# EAGLE design BitAccumulator (EAGLE 9.2.2)
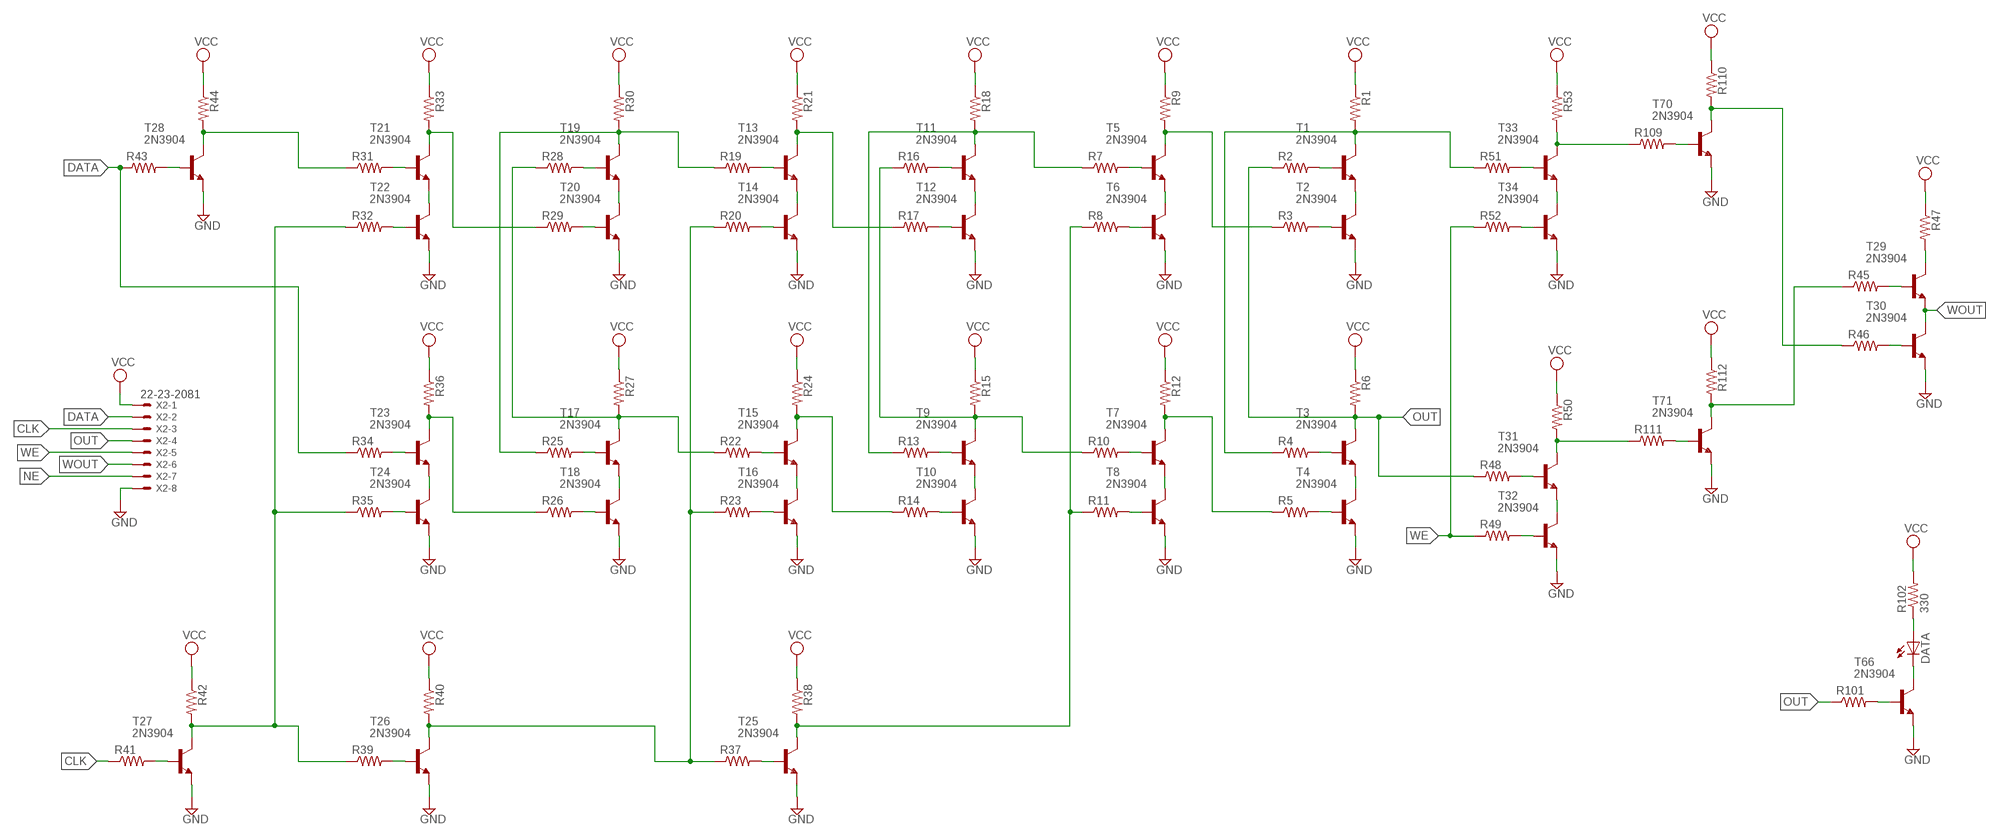
[diagram p0: schematic, sheet 1]

## Parts
DATA  LED5MM  [LED5MM]
R1  R-US_0309/10  [0309/10]
R2  R-US_0309/10  [0309/10]
R3  R-US_0309/10  [0309/10]
R4  R-US_0309/10  [0309/10]
R5  R-US_0309/10  [0309/10]
R6  R-US_0309/10  [0309/10]
R7  R-US_0309/10  [0309/10]
R8  R-US_0309/10  [0309/10]
R9  R-US_0309/10  [0309/10]
R10  R-US_0309/10  [0309/10]
R11  R-US_0309/10  [0309/10]
R12  R-US_0309/10  [0309/10]
R13  R-US_0309/10  [0309/10]
R14  R-US_0309/10  [0309/10]
R15  R-US_0309/10  [0309/10]
R16  R-US_0309/10  [0309/10]
R17  R-US_0309/10  [0309/10]
R18  R-US_0309/10  [0309/10]
R19  R-US_0309/10  [0309/10]
R20  R-US_0309/10  [0309/10]
R21  R-US_0309/10  [0309/10]
R22  R-US_0309/10  [0309/10]
R23  R-US_0309/10  [0309/10]
R24  R-US_0309/10  [0309/10]
R25  R-US_0309/10  [0309/10]
R26  R-US_0309/10  [0309/10]
R27  R-US_0309/10  [0309/10]
R28  R-US_0309/10  [0309/10]
R29  R-US_0309/10  [0309/10]
R30  R-US_0309/10  [0309/10]
R31  R-US_0309/10  [0309/10]
R32  R-US_0309/10  [0309/10]
R33  R-US_0309/10  [0309/10]
R34  R-US_0309/10  [0309/10]
R35  R-US_0309/10  [0309/10]
R36  R-US_0309/10  [0309/10]
R37  R-US_0309/10  [0309/10]
R38  R-US_0309/10  [0309/10]
R39  R-US_0309/10  [0309/10]
R40  R-US_0309/10  [0309/10]
R41  R-US_0309/10  [0309/10]
R42  R-US_0309/10  [0309/10]
R43  R-US_0309/10  [0309/10]
R44  R-US_0309/10  [0309/10]
R45  R-US_0309/10  [0309/10]
R46  R-US_0309/10  [0309/10]
R47  R-US_0309/10  [0309/10]
R48  R-US_0309/10  [0309/10]
R49  R-US_0309/10  [0309/10]
R50  R-US_0309/10  [0309/10]
R51  R-US_0309/10  [0309/10]
R52  R-US_0309/10  [0309/10]
R53  R-US_0309/10  [0309/10]
R101  R-US_0309/10  [0309/10]
R102  330  R-US_0309/10  [0309/10]
R109  R-US_0309/10  [0309/10]
R110  R-US_0309/10  [0309/10]
R111  R-US_0309/10  [0309/10]
R112  R-US_0309/10  [0309/10]
T1  2N3904  [TO92]
T2  2N3904  [TO92]
T3  2N3904  [TO92]
T4  2N3904  [TO92]
T5  2N3904  [TO92]
T6  2N3904  [TO92]
T7  2N3904  [TO92]
T8  2N3904  [TO92]
T9  2N3904  [TO92]
T10  2N3904  [TO92]
T11  2N3904  [TO92]
T12  2N3904  [TO92]
T13  2N3904  [TO92]
T14  2N3904  [TO92]
T15  2N3904  [TO92]
T16  2N3904  [TO92]
T17  2N3904  [TO92]
T18  2N3904  [TO92]
T19  2N3904  [TO92]
T20  2N3904  [TO92]
T21  2N3904  [TO92]
T22  2N3904  [TO92]
T23  2N3904  [TO92]
T24  2N3904  [TO92]
T25  2N3904  [TO92]
T26  2N3904  [TO92]
T27  2N3904  [TO92]
T28  2N3904  [TO92]
T29  2N3904  [TO92]
T30  2N3904  [TO92]
T31  2N3904  [TO92]
T32  2N3904  [TO92]
T33  2N3904  [TO92]
T34  2N3904  [TO92]
T66  2N3904  [TO92]
T70  2N3904  [TO92]
T71  2N3904  [TO92]
X2  22-23-2081  [22-23-2081]

## Nets
CLK: R41.1 X2.3
DATA: R34.1 R43.1 X2.2
GND: T2.3(E) T4.3(E) T6.3(E) T8.3(E) T10.3(E) T12.3(E) T14.3(E) T16.3(E) T18.3(E) T20.3(E) T22.3(E) T24.3(E) T25.3(E) T26.3(E) T27.3(E) T28.3(E) T30.3(E) T32.3(E) T34.3(E) T66.3(E) T70.3(E) T71.3(E) X2.8
N$1: R31.1 R44.2 T28.1(C)
N$2: R43.2 T28.2(B)
N$3: T31.3(E) T32.1(C)
N$4: R41.2 T27.2(B)
N$5: R39.2 T26.2(B)
N$7: R37.2 T25.2(B)
N$8: R101.2 T66.2(B)
N$9: R29.1 R33.2 T21.1(C)
N$10: R31.2 T21.2(B)
N$11: R32.2 T22.2(B)
N$12: R46.2 T30.2(B)
N$13: R28.2 T19.2(B)
N$14: R29.2 T20.2(B)
N$15: T19.3(E) T20.1(C)
N$16: R19.1 R25.1 R30.2 T19.1(C)
N$17: R17.1 R21.2 T13.1(C)
N$18: T13.3(E) T14.1(C)
N$19: R20.2 T14.2(B)
N$20: R19.2 T13.2(B)
N$21: R26.1 R36.2 T23.1(C)
N$22: T23.3(E) T24.1(C)
N$23: R35.2 T24.2(B)
N$24: R34.2 T23.2(B)
N$25: R25.2 T17.2(B)
N$26: R22.1 R27.2 R28.1 T17.1(C)
N$27: T17.3(E) T18.1(C)
N$28: R26.2 T18.2(B)
N$29: R22.2 T15.2(B)
N$30: R23.2 T16.2(B)
N$31: T15.3(E) T16.1(C)
N$32: R10.1 R15.2 R16.1 T9.1(C)
N$33: R7.1 R13.1 R18.2 T11.1(C)
N$34: T11.3(E) T12.1(C)
N$35: R17.2 T12.2(B)
N$36: R16.2 T11.2(B)
N$37: R45.2 T29.2(B)
N$38: R13.2 T9.2(B)
N$39: R14.2 T10.2(B)
N$40: T9.3(E) T10.1(C)
N$41: R3.1 R9.2 T5.1(C)
N$42: R7.2 T5.2(B)
N$43: R8.2 T6.2(B)
N$44: T5.3(E) T6.1(C)
N$45: R5.1 R12.2 T7.1(C)
N$46: R10.2 T7.2(B)
N$47: R11.2 T8.2(B)
N$48: T7.3(E) T8.1(C)
N$49: R5.2 T4.2(B)
N$50: R4.2 T3.2(B)
N$51: DATA.A R102.1
N$52: T3.3(E) T4.1(C)
N$53: R3.2 T2.2(B)
N$54: R2.2 T1.2(B)
N$55: T1.3(E) T2.1(C)
N$56: R1.2 R4.1 R51.1 T1.1(C)
N$57: R53.2 R109.1 T33.1(C)
N$58: T33.3(E) T34.1(C)
N$59: R14.1 R24.2 T15.1(C)
N$60: R51.2 T33.2(B)
N$61: R52.2 T34.2(B)
N$62: DATA.K(C) T66.1(C)
N$63: T21.3(E) T22.1(C)
N$64: R49.2 T32.2(B)
N$65: R48.2 T31.2(B)
N$66: R50.2 R111.1 T31.1(C)
N$68: R8.1 R11.1 R38.2 T25.1(C)
N$99: R47.2 T29.1(C)
N$114: R32.1 R35.1 R39.1 R42.2 T27.1(C)
N$116: R20.1 R23.1 R37.1 R40.2 T26.1(C)
N$137: R109.2 T70.2(B)
N$138: R46.1 R110.2 T70.1(C)
N$139: R111.2 T71.2(B)
N$140: R45.1 R112.2 T71.1(C)
NE: X2.7
OUT: R2.1 R6.2 R48.1 R101.1 T3.1(C) X2.4
VCC: R1.1 R6.1 R9.1 R12.1 R15.1 R18.1 R21.1 R24.1 R27.1 R30.1 R33.1 R36.1 R38.1 R40.1 R42.1 R44.1 R47.1 R50.1 R53.1 R102.2 R110.1 R112.1 X2.1
WE: R49.1 R52.1 X2.5
WOUT: T29.3(E) T30.1(C) X2.6

## Library data of the parts
DATA = led:LED: LED OSRAM: - CHIPLED LG R971, LG N971, LY N971, LG Q971, LY Q971, LO R971, LY R971 LH N974, LH R974 LS Q976, LO Q976, LY Q976 LO Q996 - Hyper CHIPLED LW Q18S LB Q993, LB Q99A, LB R99A - SideLED LS A670, LO A670, LY A670, LG A670, LP A670 LB A673, LV A673, LT A673, LW A673 LH A674 LY A675 LS A676, LA A676, LO A676, LY A676, LW A676 LS A679, LY A679, LG A679 - Hyper Micro SIDELED® LS Y876, LA Y876, LO Y876, LY Y876 LT Y87S - SmartLED LW L88C, LW L88S LB L89C, LB L89S, LG L890 LS L89K, LO L89K, LY L89K LS L896, LA L896, LO L896, LY L896 - TOPLED LS T670, LO T670, LY T670, LG T670, LP T670 LSG T670, LSP T670, LSY T670, LOP T670, LYG T670 LG T671, LOG T671, LSG T671 LB T673, LV T673, LT T673, LW T673 LH T674 LS T676, LA T676, LO T676, LY T676, LB T676, LH T676, LSB T676, LW T676 LB T67C, LV T67C, LT T67C, LS T67K, LO T67K, LY T67K, LW E67C LS E67B, LA E67B, LO E67B, LY E67B, LB E67C, LV E67C, LT E67C LW T67C LS T679, LY T679, LG T679 LS T770, LO T770, LY T770, LG T770, LP T770 LB T773, LV T773, LT T773, LW T773 LH T774 LS E675, LA E675, LY E675, LS T675 LS T776, LA T776, LO T776, LY T776, LB T776 LHGB T686 LT T68C, LB T68C - Hyper Mini TOPLED® LB M676 - Mini TOPLED Santana® LG M470 LS M47K, LO M47K, LY M47K Source: http://www.osram.convergy.de LUXEON: - LUMILED® LXK2-PW12-R00, LXK2-PW12-S00, LXK2-PW14-U00, LXK2-PW14-V00 LXK2-PM12-R00, LXK2-PM12-S00, LXK2-PM14-U00 LXK2-PE12-Q00, LXK2-PE12-R00, LXK2-PE12-S00, LXK2-PE14-T00, LXK2-PE14-U00 LXK2-PB12-K00, LXK2-PB12-L00, LXK2-PB12-M00, LXK2-PB14-N00, LXK2-PB14-P00, LXK2-PB14-Q00 LXK2-PR12-L00, LXK2-PR12-M00, LXK2-PR14-Q00, LXK2-PR14-R00 LXK2-PD12-Q00, LXK2-PD12-R00, LXK2-PD12-S00 LXK2-PH12-R00, LXK2-PH12-S00 LXK2-PL12-P00, LXK2-PL12-Q00, LXK2-PL12-R00 Source: www.luxeon.com KINGBRIGHT: KA-3528ASYC Source: www.kingbright.com
R1-R53 R101 R102 R109-R112 = resistor:R-US_: RESISTOR, American symbol
T1-T34 T66 T70 T71 = transistor:2N3904: NPN TRANSISTOR
X2 = con-molex:22-23-2081: .100" (2.54mm) Center Header - 8 Pin; MF: MOLEX; MPN: 22-23-2081; OC_FARNELL: 1756826; OC_NEWARK: 01C7592

## Board
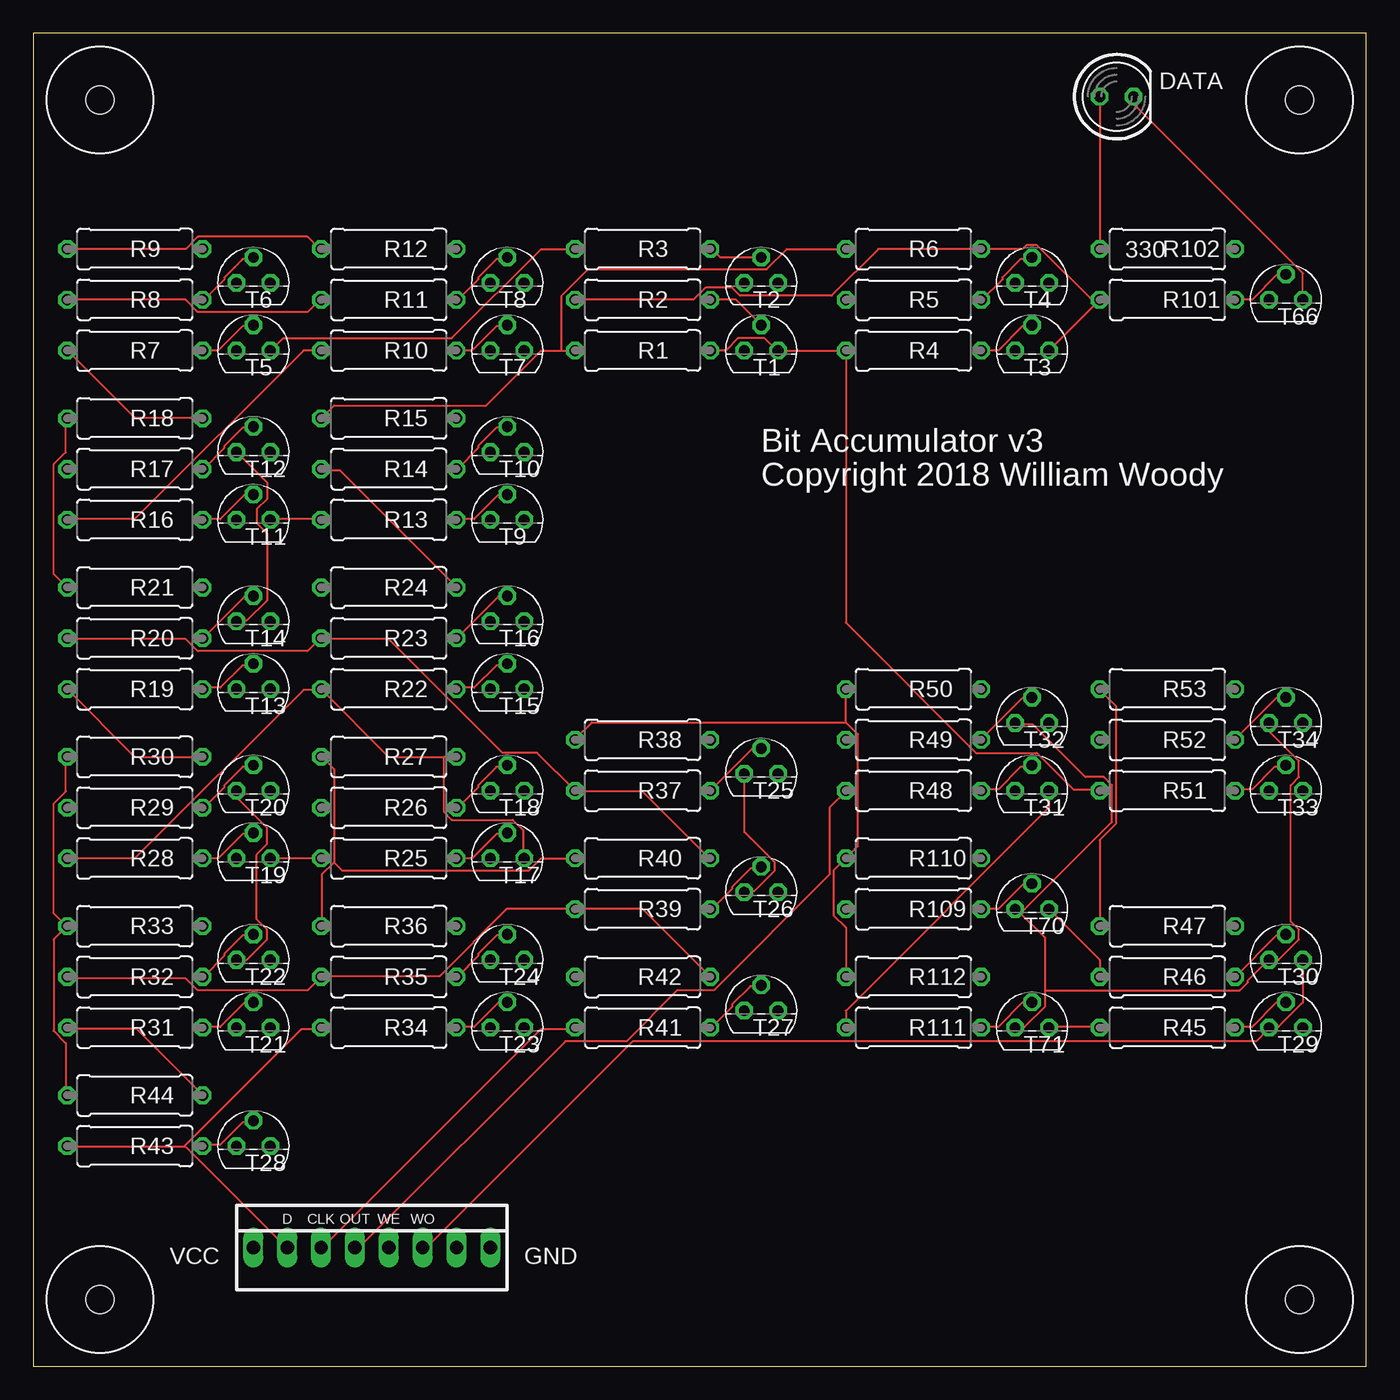
[diagram p1: board, top side]
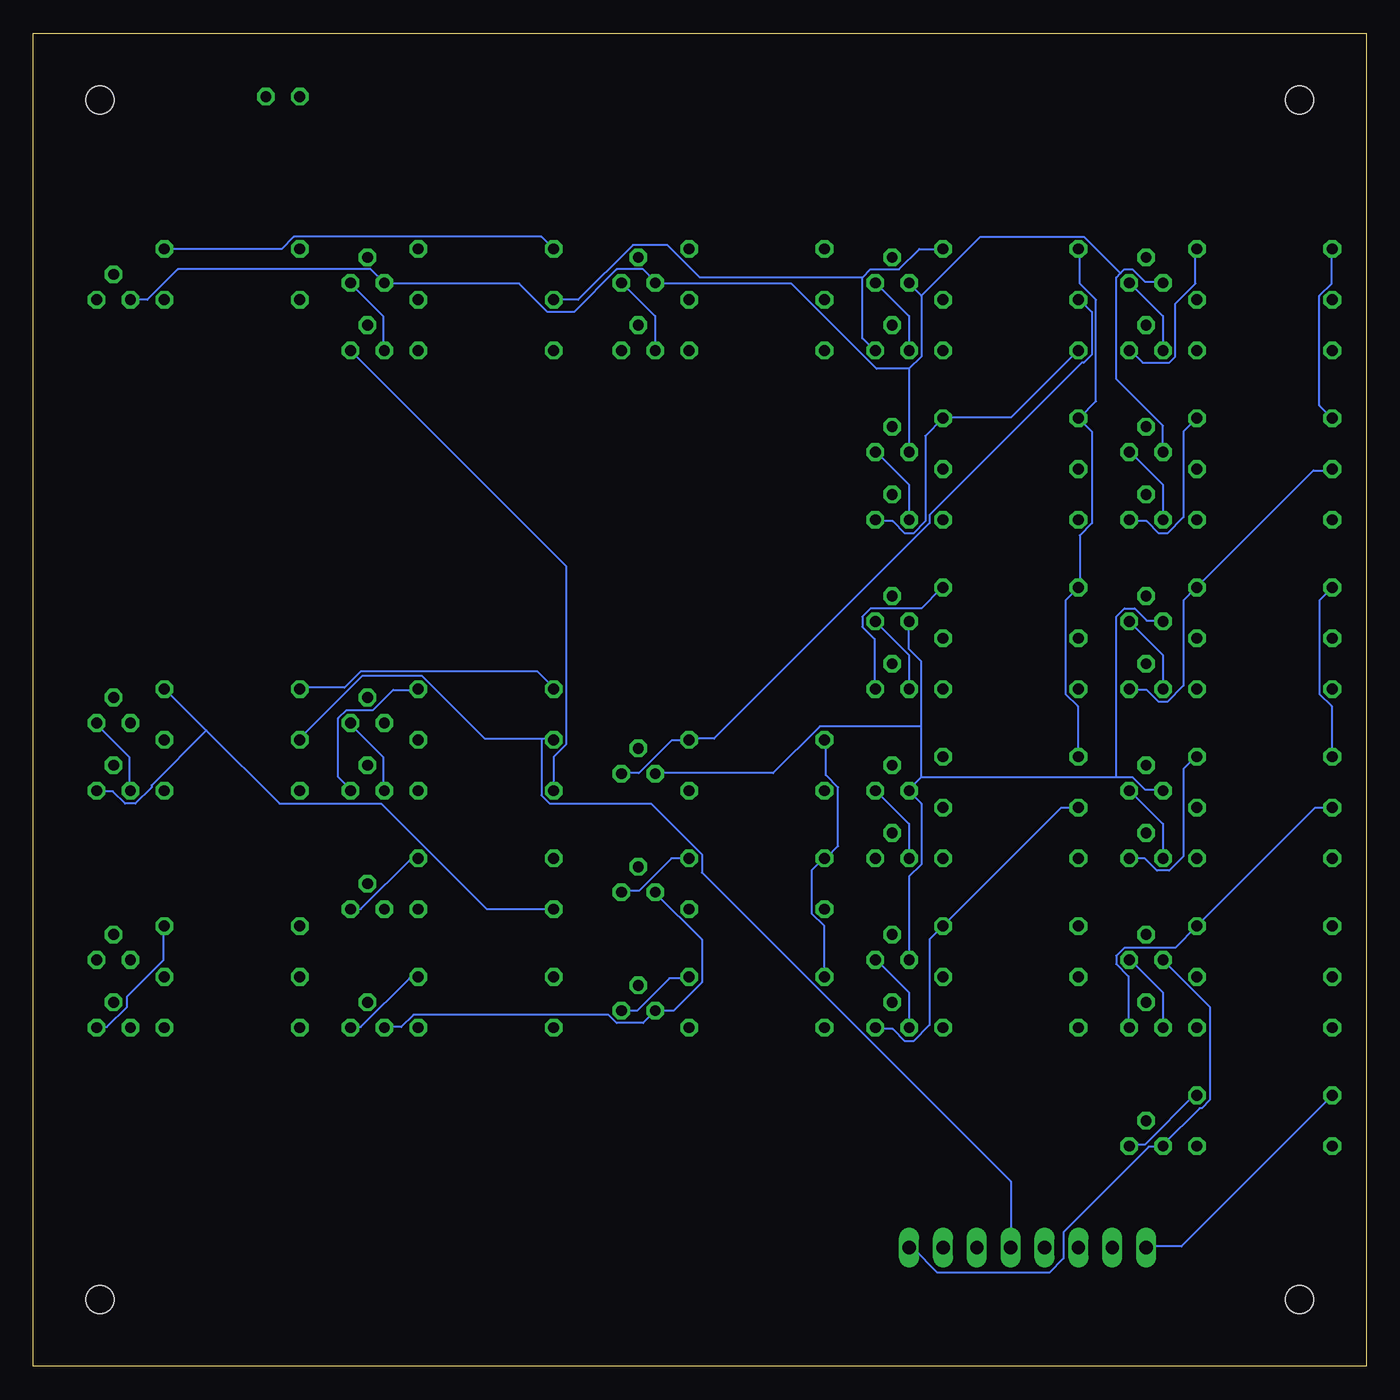
[diagram p2: board, bottom side, seen from below]

Size 100 x 100 mm. Coordinates in mm from the lower left corner, seen from the top.
Outline: 0,0 100,0 100,100 0,100 0,0
Copper layers (1*16): Top 0.035mm / dielectric 1.5mm / Bottom 0.035mm
Design rules "default": minimum track width 6mil, minimum drill 0.35mm, track to track 6mil, track to pad 6mil, pad to pad 6mil, via to via 6mil, smd to smd 6mil, copper to edge 40mil, drill to drill 6mil, minimum pad ring 10mil, minimum via ring 8mil, stop-mask expansion 4mil, vias tented up to drill 0mil, thermal gap 10mil
Holes 2.1 mm at 5,95 95,95 95,5 5,5

### Footprints (pad centres in the part's own frame; a part is rotated, then mirrored left to right if it is on the bottom)
LED5MM = drill 0.813 octagon: A -1.27,0; K 1.27,0
0309/10 = drill 0.813 octagon: 1 -5.08,0; 2 5.08,0
TO92 = drill 0.813 octagon: 1 1.27,0; 2 0,1.905; 3 -1.27,0
22-23-2081 = drill 1 long: 1 -8.89,0; 2 -6.35,0; 3 -3.81,0; 4 -1.27,0; 5 1.27,0; 6 3.81,0; 7 6.35,0; 8 8.89,0

### Placement (x,y rotation side)
DATA  81.28,95.25 0 top
R1  45.72,76.2 0 top
R2  45.72,80.01 0 top
R3  45.72,83.82 0 top
R4  66.04,76.2 0 top
R5  66.04,80.01 0 top
R6  66.04,83.82 0 top
R7  7.62,76.2 0 top
R8  7.62,80.01 0 top
R9  7.62,83.82 0 top
R10  26.67,76.2 0 top
R11  26.67,80.01 0 top
R12  26.67,83.82 0 top
R13  26.67,63.5 0 top
R14  26.67,67.31 0 top
R15  26.67,71.12 0 top
R16  7.62,63.5 0 top
R17  7.62,67.31 0 top
R18  7.62,71.12 0 top
R19  7.62,50.8 0 top
R20  7.62,54.61 0 top
R21  7.62,58.42 0 top
R22  26.67,50.8 0 top
R23  26.67,54.61 0 top
R24  26.67,58.42 0 top
R25  26.67,38.1 0 top
R26  26.67,41.91 0 top
R27  26.67,45.72 0 top
R28  7.62,38.1 0 top
R29  7.62,41.91 0 top
R30  7.62,45.72 0 top
R31  7.62,25.4 0 top
R32  7.62,29.21 0 top
R33  7.62,33.02 0 top
R34  26.67,25.4 0 top
R35  26.67,29.21 0 top
R36  26.67,33.02 0 top
R37  45.72,43.18 0 top
R38  45.72,46.99 0 top
R39  45.72,34.29 0 top
R40  45.72,38.1 0 top
R41  45.72,25.4 0 top
R42  45.72,29.21 0 top
R43  7.62,16.51 0 top
R44  7.62,20.32 0 top
R45  85.09,25.4 0 top
R46  85.09,29.21 0 top
R47  85.09,33.02 0 top
R48  66.04,43.18 0 top
R49  66.04,46.99 0 top
R50  66.04,50.8 0 top
R51  85.09,43.18 0 top
R52  85.09,46.99 0 top
R53  85.09,50.8 0 top
R101  85.09,80.01 0 top
R102  85.09,83.82 0 top
R109  66.04,34.29 0 top
R110  66.04,38.1 0 top
R111  66.04,25.4 0 top
R112  66.04,29.21 0 top
T1  54.61,76.2 0 top
T2  54.61,81.28 0 top
T3  74.93,76.2 0 top
T4  74.93,81.28 0 top
T5  16.51,76.2 0 top
T6  16.51,81.28 0 top
T7  35.56,76.2 0 top
T8  35.56,81.28 0 top
T9  35.56,63.5 0 top
T10  35.56,68.58 0 top
T11  16.51,63.5 0 top
T12  16.51,68.58 0 top
T13  16.51,50.8 0 top
T14  16.51,55.88 0 top
T15  35.56,50.8 0 top
T16  35.56,55.88 0 top
T17  35.56,38.1 0 top
T18  35.56,43.18 0 top
T19  16.51,38.1 0 top
T20  16.51,43.18 0 top
T21  16.51,25.4 0 top
T22  16.51,30.48 0 top
T23  35.56,25.4 0 top
T24  35.56,30.48 0 top
T25  54.61,44.45 0 top
T26  54.61,35.56 0 top
T27  54.61,26.67 0 top
T28  16.51,16.51 0 top
T29  93.98,25.4 0 top
T30  93.98,30.48 0 top
T31  74.93,43.18 0 top
T32  74.93,48.26 0 top
T33  93.98,43.18 0 top
T34  93.98,48.26 0 top
T66  93.98,80.01 0 top
T70  74.93,34.29 0 top
T71  74.93,25.4 0 top
X2  25.4,8.89 0 top

### Tracks (layer width: path | path; a pad name or v marks a point on that pad's centre or on a via)
CLK
  Top 0.152: R41.1 40.54,25.3 38.1,25.3 21.64,8.84 X2.3
DATA
  Top 0.152: 11.28,16.46 11.43,16.46 19.05,8.84 X2.2 | 11.28,16.46 2.59,16.46 R43.1 | 11.28,16.46 20.12,25.3 21.49,25.3 R34.1
GND
  Top 0.152: T12.3 17.53,66.29 17.53,65.08 16.76,64.31 16.76,63.25 17.53,62.48 17.53,57.45 16,55.93 15.24,55.93 T14.3 | T20.3 15.24,42.67 17.53,40.39 17.53,39.17 16.76,38.41 16.76,33.53 17.53,32.77 17.53,32 16,30.48 T22.3 | 75.89,28.19 75.89,32.16 74.07,33.98 | 75.89,28.19 75.89,26.98 74.37,25.45 73.76,25.45 T71.3 | 74.07,33.98 73.76,34.29 T70.3 74.07,33.98 | 74.07,33.98 80.92,40.84 80.92,43.59 80.31,44.2 78.94,44.2 74.98,48.16 73.76,48.16 T32.3 | 75.89,28.19 90.53,28.19 91.14,28.8 91.14,28.96 92.66,30.48 T30.3 93.42,30.48 94.94,32 94.94,32.77 94.34,33.38 94.34,43.59 94.94,44.2 94.94,45.41 92.81,47.55 92.81,48.16 T34.3 | T25.3 53.34,40.08 55.63,37.8 55.63,37.19 54.1,35.66 53.34,35.66 T26.3
  Bottom 0.152: 18.44,81.99 18.75,81.69 18.75,74.07 15.24,70.56 T12.3 | 18.44,81.99 18.14,82.3 17.53,82.3 16.61,81.38 15.24,81.38 T6.3 | T66.3 91.44,80.01 89.15,82.3 74.68,82.3 T4.3 73.61,81.23 63.55,81.23 61.42,79.1 59.44,79.1 56.24,82.3 54.25,82.3 53.34,81.38 T2.3 53.34,81.23 43.13,81.23 36.73,74.83 34.29,74.83 | 34.29,74.83 T10.3 | 34.29,74.83 33.38,75.74 33.38,80.31 | 33.38,80.31 34.29,81.23 T8.3 | 18.44,81.99 21.18,84.73 28.96,84.73 33.38,80.31 | T22.3 11.73,26.98 11.73,19.96 12.34,19.36 12.5,19.36 15.24,16.61 T28.3 15.24,16.46 16.31,16.46 22.71,10.06 22.71,8.08 23.77,7.01 32.16,7.01 33.98,8.84 34.29,8.84 X2.8 | T26.3 53.34,35.51 49.84,32 49.84,28.8 51.97,26.67 T27.3 54.25,25.76 56.24,25.76 56.84,26.36 71.48,26.36 72.39,25.45 73.61,25.45 T71.3 | T24.3 34.29,36.73 33.38,37.64 33.38,42.22 34.29,43.13 T18.3 34.29,43.28 33.38,44.2 | T16.3 34.29,53.8 33.38,52.88 33.38,48.01 | 33.38,44.2 33.38,48.01 | 33.38,48.01 41,48.01 44.5,44.5 53.34,44.5 T25.3 | 33.38,44.2 18.75,44.2 | 18.75,44.2 17.53,44.2 16.61,43.28 15.24,43.28 T20.3 | 18.75,44.2 18.75,56.24 18.14,56.84 17.37,56.84 16.46,55.93 15.24,55.93 T14.3
N$1
  Top 0.152: R31.1 2.59,25.3 7.77,25.3 12.65,20.42 R44.2
  Bottom 0.152: T28.1 17.68,16.61 16.61,16.61 12.8,20.42 R44.2
N$2
  Top 0.152: R43.2 12.8,16.61 14.02,16.61 15.7,18.29 16.46,18.29 T28.2
N$3
  Bottom 0.152: T31.3 73.76,43.28 73.76,45.72 76.2,48.16 T32.1
N$4
  Top 0.152: R41.2 50.9,25.45 52.43,26.98 52.43,27.13 53.8,28.5 54.56,28.5 T27.2
N$5
  Top 0.152: R39.2 50.9,34.29 52.43,35.81 52.43,35.97 53.8,37.34 54.56,37.34 T26.2
N$7
  Top 0.152: R37.2 53.95,46.33 54.56,46.33 T25.2
N$8
  Top 0.152: R101.2 91.44,80.01 93.27,81.84 93.88,81.84 T66.2
N$9
  Bottom 0.152: T21.1 17.83,25.45 17.83,29.26 18.75,30.18 18.75,30.79 18.14,31.39 14.33,31.39 R33.2 3.81,41.91 R29.1
N$10
  Top 0.152: R31.2 12.8,25.45 14.02,25.45 15.85,27.28 16.46,27.28 T21.2
N$11
  Top 0.152: R32.2 12.8,29.26 14.33,30.79 14.33,30.94 15.7,32.31 16.46,32.31 T22.2
N$12
  Top 0.152: R46.2 93.27,32.31 93.88,32.31 T30.2
N$13
  Top 0.152: R28.2 13.87,38.1 15.7,39.93 16.46,39.93 T19.2
N$14
  Top 0.152: R29.2 12.8,41.91 14.33,43.43 14.33,43.59 15.7,44.96 16.46,44.96 T20.2
N$15
  Bottom 0.152: T19.3 15.24,40.69 17.68,43.13 T20.1
N$16
  Top 0.152: R25.1 T19.1 | R30.2 7.62,45.72 R19.1
  Bottom 0.152: T19.1 16.61,38.1 15.7,37.19 14.78,37.19 13.72,38.25 13.72,44.81 12.8,45.72 R30.2
N$17
  Bottom 0.152: T13.1 17.68,50.75 16.46,50.75 15.54,49.84 14.94,49.84 13.72,51.05 13.72,57.45 12.8,58.37 R21.2 12.65,58.52 3.96,67.21 2.59,67.21 R17.1
N$18
  Bottom 0.152: T13.3 15.24,53.34 T14.1
N$19
  Top 0.152: R20.2 15.85,57.76 16.46,57.76 T14.2
N$20
  Top 0.152: R19.2 12.8,50.9 14.02,50.9 15.7,52.58 16.46,52.58 T13.2
N$21
  Bottom 0.152: T23.1 36.73,25.3 35.51,25.3 34.59,24.38 33.98,24.38 32.77,25.6 32.77,32 R36.2 22.86,41.91 R26.1
N$22
  Bottom 0.152: T23.3 34.29,28.04 36.73,30.48 T24.1
N$23
  Top 0.152: R35.2 31.85,29.26 33.38,30.79 33.38,30.94 34.75,32.31 35.51,32.31 T24.2
N$24
  Top 0.152: R34.2 31.85,25.45 33.07,25.45 34.9,27.28 35.51,27.28 T23.2
N$25
  Top 0.152: R25.2 32.92,38.1 34.75,39.93 35.51,39.93 T17.2
N$26
  Top 0.152: R28.1 7.62,38.1 20.27,50.75 21.49,50.75 R22.1 26.67,45.72 30.79,45.72 | 30.79,45.72 R27.2 | 30.79,45.72 30.79,41.6 31.39,41 35.97,41 36.73,40.23 36.73,38.1 T17.1
N$27
  Bottom 0.152: T17.3 34.29,40.69 36.73,43.13 T18.1
N$28
  Top 0.152: R26.2 31.85,41.91 33.38,43.43 33.38,43.59 34.75,44.96 35.51,44.96 T18.2
N$29
  Top 0.152: R22.2 31.85,50.9 33.07,50.9 34.75,52.58 35.51,52.58 T15.2
N$30
  Top 0.152: R23.2 34.9,57.76 35.51,57.76 T16.2
N$31
  Bottom 0.152: T15.3 34.29,53.34 T16.1
N$32
  Top 0.152: R10.1 20.27,76.2 7.62,63.55 2.59,63.55 R16.1
  Bottom 0.152: R10.1 21.64,76.2 26.67,71.17 31.7,71.17 R15.2 33.07,69.8 33.07,63.4 33.98,62.48 34.59,62.48 35.51,63.4 36.73,63.4 T9.1
N$33
  Top 0.152: T11.1 17.83,63.55 21.49,63.55 R13.1 | R18.2 12.65,71.17 7.62,71.17 2.59,76.2 R7.1
  Bottom 0.152: R18.2 13.72,70.1 13.72,63.7 14.94,62.48 15.54,62.48 16.46,63.4 17.68,63.4 T11.1
N$34
  Bottom 0.152: T11.3 15.24,66.14 17.68,68.58 T12.1
N$35
  Top 0.152: R17.2 12.8,67.36 14.33,68.89 14.33,69.04 15.7,70.41 16.46,70.41 T12.2
N$36
  Top 0.152: R16.2 12.8,63.55 14.02,63.55 15.85,65.38 16.46,65.38 T11.2
N$37
  Top 0.152: R45.2 90.22,25.45 91.44,25.45 93.27,27.28 93.88,27.28 T29.2
N$38
  Top 0.152: R13.2 31.85,63.55 33.07,63.55 34.9,65.38 35.51,65.38 T9.2
N$39
  Top 0.152: R14.2 31.85,67.36 33.38,68.89 33.38,69.04 34.75,70.41 35.51,70.41 T10.2
N$40
  Bottom 0.152: T9.3 34.29,66.14 36.73,68.58 T10.1
N$41
  Top 0.152: R3.1 38.1,83.82 31.39,77.11 18.75,77.11 17.83,76.2 T5.1
  Bottom 0.152: R9.2 12.8,83.82 12.8,81.23 14.33,79.7 14.33,75.74 14.78,75.29 16.76,75.29 17.68,76.2 T5.1
N$42
  Top 0.152: R7.2 13.87,76.2 15.7,78.03 16.46,78.03 T5.2
N$43
  Top 0.152: R8.2 12.8,80.01 14.33,81.53 14.33,81.69 15.7,83.06 16.46,83.06 T6.2
N$44
  Bottom 0.152: T5.3 15.24,78.79 17.68,81.23 T6.1
N$45
  Bottom 0.152: R12.2 33.53,83.82 35.05,82.3 37.19,82.3 37.8,81.69 | 37.8,81.69 37.8,77.11 36.88,76.2 T7.1 | R5.1 59.13,80.01 55.02,84.12 52.43,84.12 49.99,81.69 37.8,81.69
N$46
  Top 0.152: R10.2 32.92,76.2 34.75,78.03 35.51,78.03 T7.2
N$47
  Top 0.152: R11.2 31.85,80.01 33.38,81.53 33.38,81.69 34.75,83.06 35.51,83.06 T8.2
N$48
  Bottom 0.152: T7.3 34.29,78.79 36.73,81.23 T8.1
N$49
  Top 0.152: R5.2 71.17,80.01 72.69,81.53 72.69,81.69 74.07,83.06 74.83,83.06 T4.2
N$50
  Top 0.152: R4.2 72.39,76.2 74.22,78.03 74.83,78.03 T3.2
N$51
  Top 0.152: DATA.A R102.1
N$52
  Bottom 0.152: T3.3 73.76,76.2 73.76,78.79 76.2,81.23 T4.1
N$53
  Top 0.152: T2.2 54.56,83.21 51.51,83.21 50.9,83.82 R3.2
N$54
  Top 0.152: R2.2 52.73,80.01 54.56,78.18 T1.2
N$55
  Bottom 0.152: T1.3 53.34,78.79 55.78,81.23 T2.1
N$56
  Top 0.152: R1.2 51.97,76.2 52.88,77.11 54.86,77.11 55.78,76.2 T1.1 R4.1 60.96,55.78 70.71,46.02 75.29,46.02 78.03,43.28 80.01,43.28 R51.1
N$57
  Bottom 0.152: R109.1 65.99,34.29 73.91,42.22 81.53,42.22 87.02,47.7 | 87.02,47.7 90.07,50.75 R53.2 | 87.02,47.7 91.14,43.59 91.14,43.43 92.35,42.22 93.12,42.22 94.03,43.13 95.25,43.13 T33.1
N$58
  Bottom 0.152: T33.3 92.81,43.28 92.81,45.72 95.25,48.16 T34.1
N$59
  Top 0.152: R14.1 21.64,67.21 23.01,67.21 31.7,58.52 R24.2
  Bottom 0.152: T15.1 36.88,50.9 36.88,54.56 37.8,55.47 37.8,56.24 37.19,56.84 33.38,56.84 31.85,58.37 R24.2
N$60
  Top 0.152: R51.2 90.22,43.28 91.44,43.28 93.12,44.96 93.88,44.96 T33.2
N$61
  Top 0.152: R52.2 90.22,47.09 93.27,50.14 93.88,50.14 T34.2
N$62
  Top 0.152: T66.1 95.25,81.99 82.6,94.64 82.6,95.25 DATA.K
N$63
  Bottom 0.152: T21.3 15.24,28.04 17.68,30.48 T22.1
N$64
  Top 0.152: R49.2 71.17,47.09 74.22,50.14 74.83,50.14 T32.2
N$65
  Top 0.152: R48.2 71.17,43.28 72.39,43.28 74.07,44.96 74.83,44.96 T31.2
N$66
  Top 0.152: R111.1 60.96,26.67 76.2,41.91 T31.1
  Bottom 0.152: R50.2 71.17,50.75 73,50.75 74.52,49.23 76.5,49.23 77.11,48.62 77.11,44.2 76.2,43.28 T31.1
N$68
  Top 0.152: R8.1 11.43,80.01 12.34,79.1 20.57,79.1 21.49,80.01 R11.1
  Bottom 0.152: T25.1 55.78,44.5 54.56,44.5 52.12,46.94 50.9,46.94 R38.2 50.75,47.09 48.92,47.09 32.77,63.25 32.77,63.86 21.34,75.29 21.18,75.29 20.57,75.89 20.57,79.1 21.49,80.01 R11.1
N$99
  Bottom 0.152: R47.2 90.22,32.92 90.22,30.48 92.96,27.74 92.96,26.98 94.49,25.45 95.25,25.45 T29.1
N$114
  Top 0.152: R32.1 2.59,29.11 11.43,29.11 12.34,28.19 20.57,28.19 R35.1 21.64,29.26 30.48,29.26 35.51,34.29 R39.1 45.72,34.29 R42.2
  Bottom 0.152: T27.1 54.71,26.67 52.27,29.11 50.9,29.11 R42.2
N$116
  Top 0.152: R20.1 2.59,54.56 11.43,54.56 12.34,53.65 20.57,53.65 21.49,54.56 R23.1 21.64,54.56 26.67,54.56 35.2,46.02 37.8,46.02 R37.1 40.69,43.13 45.72,43.13 50.75,38.1 R40.2
  Bottom 0.152: R40.2 52.12,38.1 54.56,35.66 55.78,35.66 T26.1
N$137
  Top 0.152: R109.2 72.39,34.29 74.22,36.12 74.83,36.12 T70.2
N$138
  Top 0.152: R46.1 80.01,30.48 T70.1
  Bottom 0.152: R110.2 71.63,38.1 75.44,34.29 T70.1
N$139
  Top 0.152: R111.2 71.17,25.45 72.39,25.45 74.22,27.28 74.83,27.28 T71.2
N$140
  Top 0.152: T71.1 76.2,25.45 80.01,25.45 R45.1
  Bottom 0.152: R112.2 71.17,29.11 71.78,29.11 75.44,25.45 76.2,25.45 T71.1
OUT
  Top 0.152: R2.1 49.53,80.01 50.44,80.92 52.43,80.92 53.03,80.31 59.89,80.31 63.4,83.82 R6.2 74.22,83.82 74.52,84.12 75.29,84.12 79.7,79.7 | T3.1 79.7,79.7 | X2.4 24.23,8.99 24.54,8.99 39.93,24.38 44.5,24.38 48.31,28.19 51.05,28.19 59.74,36.88 59.74,41.91 60.96,43.13 R48.1 | 79.7,79.7 R101.1
  Bottom 0.152: R48.1 60.96,45.72 60.05,46.63 60.05,60.05 T3.1
VCC
  Top 0.152: R21.1 1.52,59.44 1.52,67.67 2.44,68.58 2.44,71.02 R18.1 | R44.1 2.44,20.42 2.44,24.23 1.52,25.15 1.52,32 R33.1 2.44,33.07 1.52,33.98 1.52,42.22 2.44,43.13 2.44,45.72 R30.1 | R47.1 80.01,39.47 81.23,40.69 81.23,49.53 80.01,50.75 R53.1 | R112.1 60.96,32.92 60.05,33.83 60.05,37.19 R110.1 61.87,39.01 61.87,47.4 60.96,48.31 | 60.96,48.31 R50.1 | 22.55,37.8 21.64,36.88 21.64,33.07 R36.1 | 22.55,37.8 22.55,44.81 21.64,45.72 R27.1 | 39.62,76.2 38.1,76.2 33.98,72.08 22.55,72.08 R15.1 | 39.62,76.2 R1.1 | R6.1 56.54,83.82 55.02,82.3 41.6,82.3 39.62,80.31 39.62,76.2 | R40.1 38.1,38.1 37.19,37.19 23.16,37.19 22.55,37.8 | 60.96,48.31 41.91,48.31 40.69,47.09 R38.1 | R9.1 11.43,83.82 12.34,84.73 20.57,84.73 21.49,83.82 R12.1
  Bottom 0.152: R21.1 3.5,57.45 3.5,50.44 2.59,49.53 2.59,45.72 R30.1 | R18.1 3.5,72.08 3.5,80.31 2.59,81.23 2.59,83.82 R9.1 | R44.1 13.87,8.99 16.46,8.99 X2.1 | R53.1 80.01,50.9 76.66,50.9 75.44,52.12 62.18,52.12 60.96,50.9 R50.1 | R42.1 40.69,29.26 40.69,33.07 41.6,33.98 41.6,37.19 40.69,38.1 R40.1 40.54,38.1 39.62,39.01 39.62,43.43 40.54,44.35 40.54,46.94 R38.1 | R12.1 21.49,83.82 21.49,81.23 20.27,80.01 20.27,72.39 21.49,71.17 R15.1 20.57,70.1 20.57,63.25 21.49,62.33 21.49,58.52 R24.1 22.55,57.45 22.55,50.44 21.64,49.53 21.64,45.72 R27.1 | R102.2 81.38,83.82 80.47,84.73 61.87,84.73 R6.1
WE
  Bottom 0.152: 61.87,47.09 66.14,47.09 70.87,51.82 75.29,51.82 80.01,47.09 R52.1 | 61.87,47.09 60.96,47.09 R49.1 | X2.5 26.67,13.87 49.84,37.03 49.84,38.41 53.65,42.22 61.27,42.22 61.87,42.82 61.87,47.09
WOUT
  Top 0.152: T30.1 95.25,27.28 93.42,25.45 92.81,25.45 T29.3 92.66,25.3 91.75,24.38 44.96,24.38 29.57,8.99 29.26,8.99 X2.6

### Text on the board
tPlace: Bit Accumulator v3 | Copyright 2018 William Woody | D | CLK | OUT | WE | WO | VCC | GND